# EAGLE design Monarch (EAGLE 7.4.0)

## Sheet 1 of 2
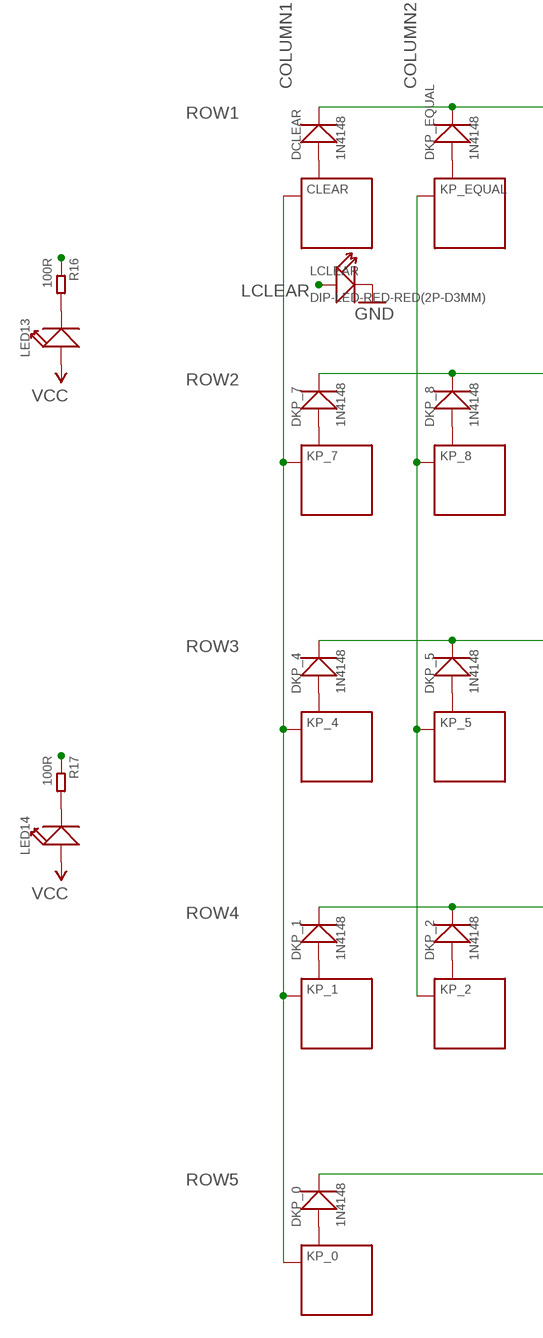
[diagram p0: schematic, sheet 1, part 1 of 2]
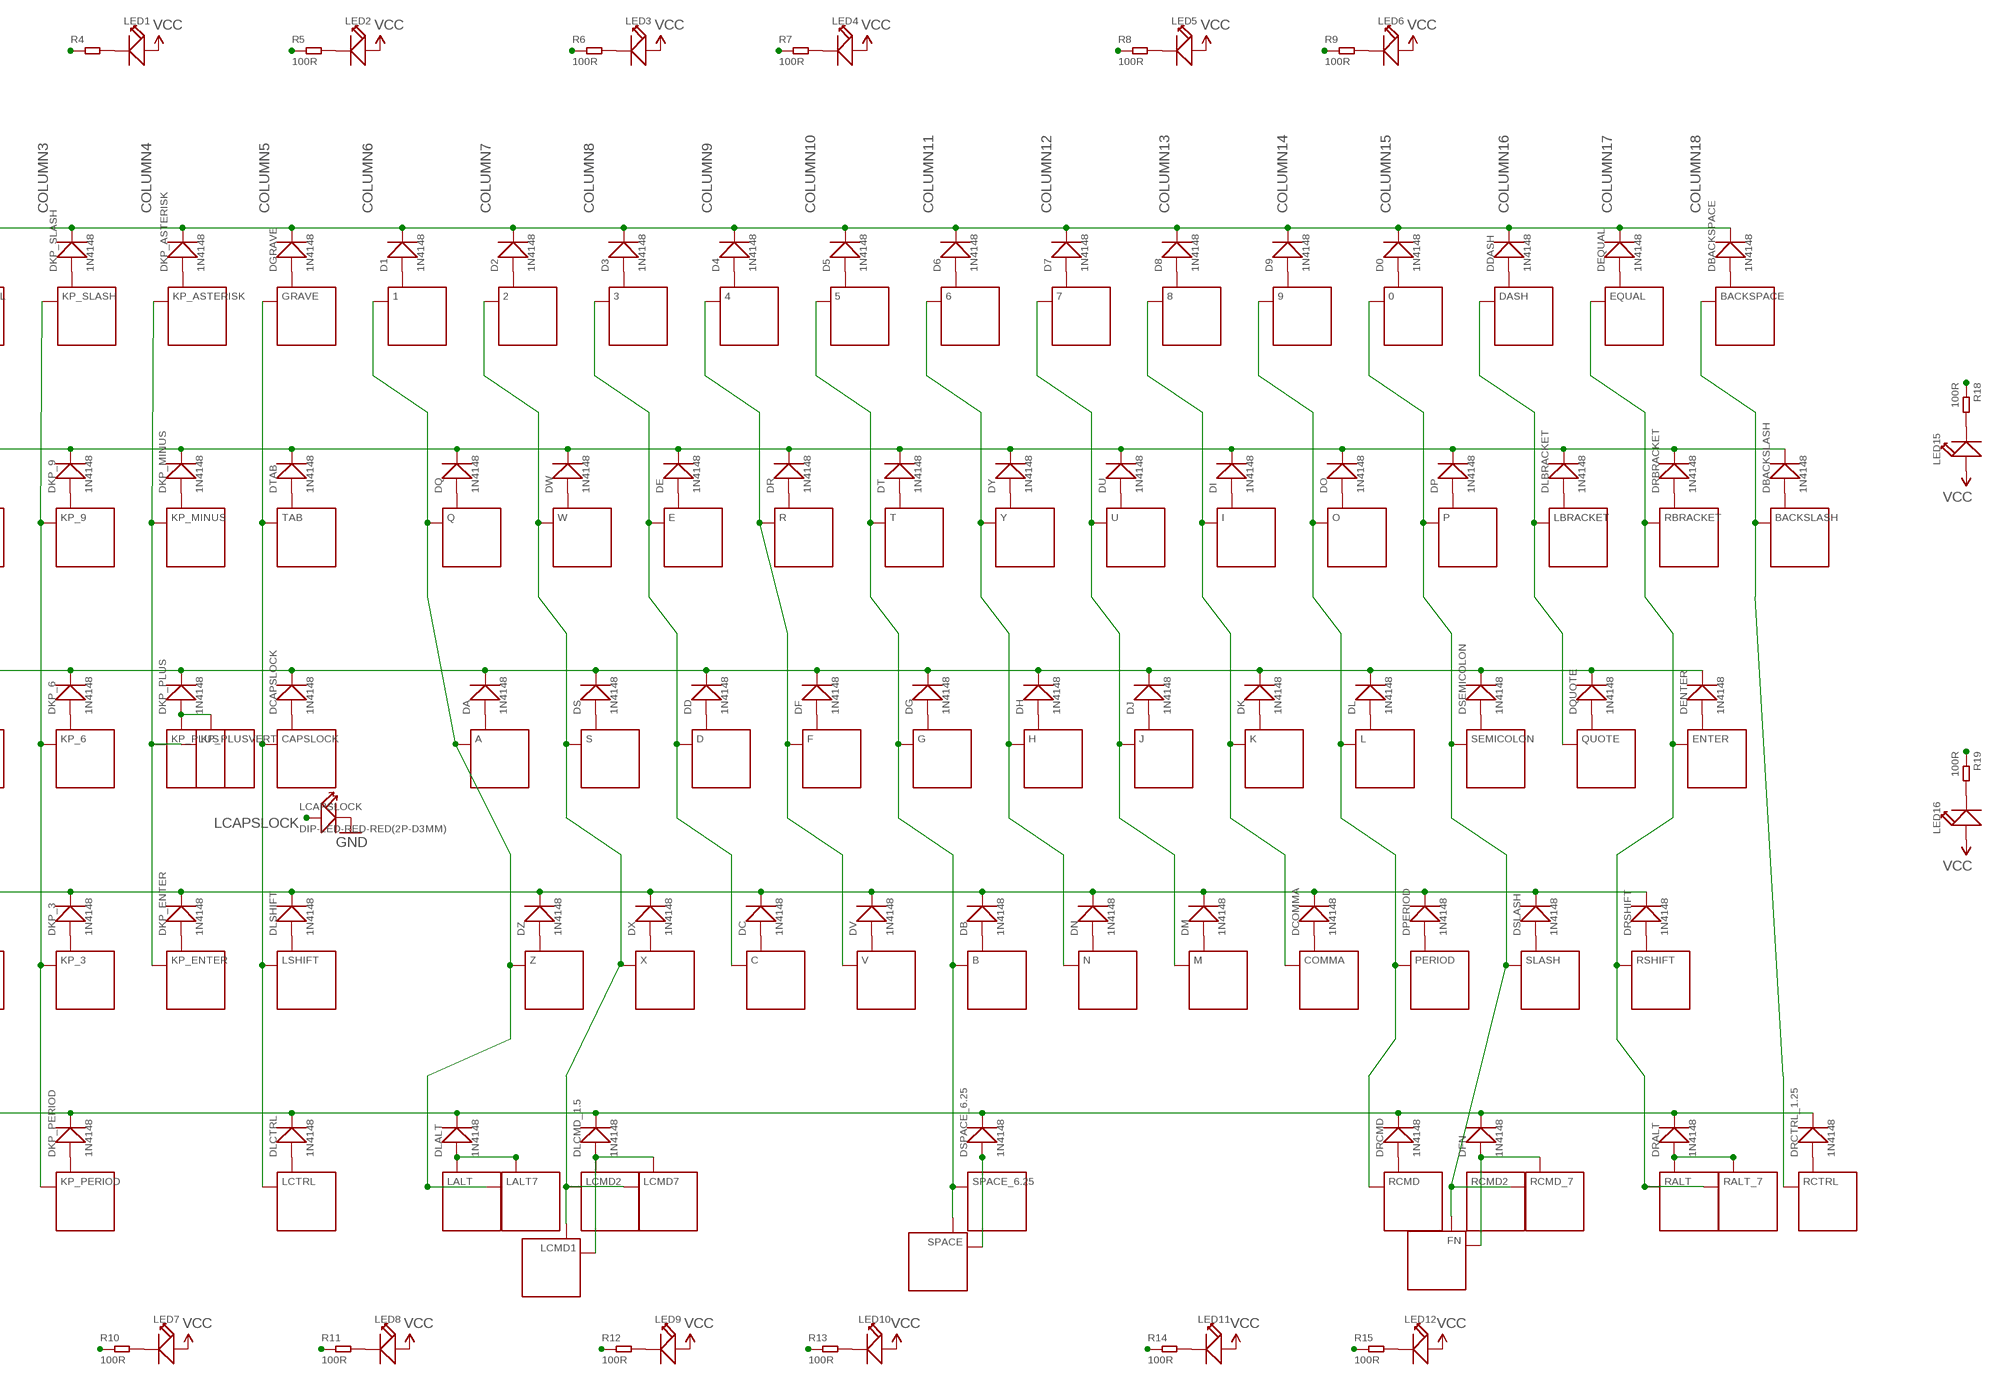
[diagram p1: schematic, sheet 1, part 2 of 2]

### Parts
0  ALPS  [P-ALPS]
1  ALPS  [P-ALPS]
2  ALPS  [P-ALPS]
3  ALPS  [P-ALPS]
4  ALPS  [P-ALPS]
5  ALPS  [P-ALPS]
6  ALPS  [P-ALPS]
7  ALPS  [P-ALPS]
8  ALPS  [P-ALPS]
9  ALPS  [P-ALPS]
A  ALPS  [P-ALPS]
B  ALPS  [P-ALPS]
BACKSLASH  ALPS  [P-ALPS]
BACKSPACE  ALPS  [P-ALPS]
C  ALPS  [P-ALPS]
CAPSLOCK  ALPS  [P-ALPS]
CLEAR  ALPS  [P-ALPS]
COMMA  ALPS  [P-ALPS]
D  ALPS  [P-ALPS]
D0  1N4148  DIODE'1206'  [SOD-123]
D1  1N4148  DIODE'1206'  [SOD-123]
D2  1N4148  DIODE'1206'  [SOD-123]
D3  1N4148  DIODE'1206'  [SOD-123]
D4  1N4148  DIODE'1206'  [SOD-123]
D5  1N4148  DIODE'1206'  [SOD-123]
D6  1N4148  DIODE'1206'  [SOD-123]
D7  1N4148  DIODE'1206'  [SOD-123]
D8  1N4148  DIODE'1206'  [SOD-123]
D9  1N4148  DIODE'1206'  [SOD-123]
DA  1N4148  DIODE'1206'  [SOD-123]
DASH  ALPS  [P-ALPS]
DB  1N4148  DIODE'1206'  [SOD-123]
DBACKSLASH  1N4148  DIODE'1206'  [SOD-123]
DBACKSPACE  1N4148  DIODE'1206'  [SOD-123]
DC  1N4148  DIODE'1206'  [SOD-123]
DCAPSLOCK  1N4148  DIODE'1206'  [SOD-123]
DCLEAR  1N4148  DIODE'1206'  [SOD-123]
DCOMMA  1N4148  DIODE'1206'  [SOD-123]
DD  1N4148  DIODE'1206'  [SOD-123]
DDASH  1N4148  DIODE'1206'  [SOD-123]
DE  1N4148  DIODE'1206'  [SOD-123]
DENTER  1N4148  DIODE'1206'  [SOD-123]
DEQUAL  1N4148  DIODE'1206'  [SOD-123]
DF  1N4148  DIODE'1206'  [SOD-123]
DFN  1N4148  DIODE'1206'  [SOD-123]
DG  1N4148  DIODE'1206'  [SOD-123]
DGRAVE  1N4148  DIODE'1206'  [SOD-123]
DH  1N4148  DIODE'1206'  [SOD-123]
DI  1N4148  DIODE'1206'  [SOD-123]
DJ  1N4148  DIODE'1206'  [SOD-123]
DK  1N4148  DIODE'1206'  [SOD-123]
DKP_0  1N4148  DIODE'1206'  [SOD-123]
DKP_1  1N4148  DIODE'1206'  [SOD-123]
DKP_2  1N4148  DIODE'1206'  [SOD-123]
DKP_3  1N4148  DIODE'1206'  [SOD-123]
DKP_4  1N4148  DIODE'1206'  [SOD-123]
DKP_5  1N4148  DIODE'1206'  [SOD-123]
DKP_6  1N4148  DIODE'1206'  [SOD-123]
DKP_7  1N4148  DIODE'1206'  [SOD-123]
DKP_8  1N4148  DIODE'1206'  [SOD-123]
DKP_9  1N4148  DIODE'1206'  [SOD-123]
DKP_ASTERISK  1N4148  DIODE'1206'  [SOD-123]
DKP_ENTER  1N4148  DIODE'1206'  [SOD-123]
DKP_EQUAL  1N4148  DIODE'1206'  [SOD-123]
DKP_MINUS  1N4148  DIODE'1206'  [SOD-123]
DKP_PERIOD  1N4148  DIODE'1206'  [SOD-123]
DKP_PLUS  1N4148  DIODE'1206'  [SOD-123]
DKP_SLASH  1N4148  DIODE'1206'  [SOD-123]
DL  1N4148  DIODE'1206'  [SOD-123]
DLALT  1N4148  DIODE'1206'  [SOD-123]
DLBRACKET  1N4148  DIODE'1206'  [SOD-123]
DLCMD_1.5  1N4148  DIODE'1206'  [SOD-123]
DLCTRL  1N4148  DIODE'1206'  [SOD-123]
DLSHIFT  1N4148  DIODE'1206'  [SOD-123]
DM  1N4148  DIODE'1206'  [SOD-123]
DN  1N4148  DIODE'1206'  [SOD-123]
DO  1N4148  DIODE'1206'  [SOD-123]
DP  1N4148  DIODE'1206'  [SOD-123]
DPERIOD  1N4148  DIODE'1206'  [SOD-123]
DQ  1N4148  DIODE'1206'  [SOD-123]
DQUOTE  1N4148  DIODE'1206'  [SOD-123]
DR  1N4148  DIODE'1206'  [SOD-123]
DRALT  1N4148  DIODE'1206'  [SOD-123]
DRBRACKET  1N4148  DIODE'1206'  [SOD-123]
DRCMD  1N4148  DIODE'1206'  [SOD-123]
DRCTRL_1.25  1N4148  DIODE'1206'  [SOD-123]
DRSHIFT  1N4148  DIODE'1206'  [SOD-123]
DS  1N4148  DIODE'1206'  [SOD-123]
DSEMICOLON  1N4148  DIODE'1206'  [SOD-123]
DSLASH  1N4148  DIODE'1206'  [SOD-123]
DSPACE_6.25  1N4148  DIODE'1206'  [SOD-123]
DT  1N4148  DIODE'1206'  [SOD-123]
DTAB  1N4148  DIODE'1206'  [SOD-123]
DU  1N4148  DIODE'1206'  [SOD-123]
DV  1N4148  DIODE'1206'  [SOD-123]
DW  1N4148  DIODE'1206'  [SOD-123]
DX  1N4148  DIODE'1206'  [SOD-123]
DY  1N4148  DIODE'1206'  [SOD-123]
DZ  1N4148  DIODE'1206'  [SOD-123]
E  ALPS  [P-ALPS]
ENTER  ALPS  [P-ALPS]
EQUAL  ALPS  [P-ALPS]
F  ALPS  [P-ALPS]
FN  ALPS  [P-ALPS]
G  ALPS  [P-ALPS]
GRAVE  ALPS  [P-ALPS]
H  ALPS  [P-ALPS]
I  ALPS  [P-ALPS]
J  ALPS  [P-ALPS]
K  ALPS  [P-ALPS]
KP_0  ALPS  [P-ALPS]
KP_1  ALPS  [P-ALPS]
KP_2  ALPS  [P-ALPS]
KP_3  ALPS  [P-ALPS]
KP_4  ALPS  [P-ALPS]
KP_5  ALPS  [P-ALPS]
KP_6  ALPS  [P-ALPS]
KP_7  ALPS  [P-ALPS]
KP_8  ALPS  [P-ALPS]
KP_9  ALPS  [P-ALPS]
KP_ASTERISK  ALPS  [P-ALPS]
KP_ENTER  ALPS  [P-ALPS]
KP_EQUAL  ALPS  [P-ALPS]
KP_MINUS  ALPS  [P-ALPS]
KP_PERIOD  ALPS  [P-ALPS]
KP_PLUS  ALPS  [P-ALPS]
KP_PLUSVERT  ALPS  [P-ALPS]
KP_SLASH  ALPS  [P-ALPS]
L  ALPS  [P-ALPS]
LALT  ALPS-2SWITCH-0.5  [P-ALPS-2SWITCH-0.5]
LALT7  ALPS  [P-ALPS]
LBRACKET  ALPS  [P-ALPS]
LCAPSLOCK  DIP-LED-RED-RED(2P-D3MM)  [LED2-2.54-D3.0MM]
LCLEAR  DIP-LED-RED-RED(2P-D3MM)  [LED2-2.54-D3.0MM]
LCMD1  ALPS  [P-ALPS]
LCMD2  ALPS  [P-ALPS]
LCMD7  ALPS  [P-ALPS]
LCTRL  ALPS-2SWITCH-0.25  [P-ALPS-2SWITCH-0.25]
LED1  SMD-LED-GENERIC  [P-SMD-LED-GENERIC]
LED2  SMD-LED-GENERIC  [P-SMD-LED-GENERIC]
LED3  SMD-LED-GENERIC  [P-SMD-LED-GENERIC]
LED4  SMD-LED-GENERIC  [P-SMD-LED-GENERIC]
LED5  SMD-LED-GENERIC  [P-SMD-LED-GENERIC]
LED6  SMD-LED-GENERIC  [P-SMD-LED-GENERIC]
LED7  SMD-LED-GENERIC  [P-SMD-LED-GENERIC]
LED8  SMD-LED-GENERIC  [P-SMD-LED-GENERIC]
LED9  SMD-LED-GENERIC  [P-SMD-LED-GENERIC]
LED10  SMD-LED-GENERIC  [P-SMD-LED-GENERIC]
LED11  SMD-LED-GENERIC  [P-SMD-LED-GENERIC]
LED12  SMD-LED-GENERIC  [P-SMD-LED-GENERIC]
LED13  SMD-LED-GENERIC  [P-SMD-LED-GENERIC]
LED14  SMD-LED-GENERIC  [P-SMD-LED-GENERIC]
LED15  SMD-LED-GENERIC  [P-SMD-LED-GENERIC]
LED16  SMD-LED-GENERIC  [P-SMD-LED-GENERIC]
LSHIFT  ALPS  [P-ALPS]
M  ALPS  [P-ALPS]
N  ALPS  [P-ALPS]
O  ALPS  [P-ALPS]
P  ALPS  [P-ALPS]
PERIOD  ALPS  [P-ALPS]
Q  ALPS  [P-ALPS]
QUOTE  ALPS  [P-ALPS]
R  ALPS  [P-ALPS]
R4  SMD-RES-100R-5%-1/8W(0805)  [R0805]
R5  100R  SMD-RES-100R-5%-1/8W(0805)  [R0805]
R6  100R  SMD-RES-100R-5%-1/8W(0805)  [R0805]
R7  100R  SMD-RES-100R-5%-1/8W(0805)  [R0805]
R8  100R  SMD-RES-100R-5%-1/8W(0805)  [R0805]
R9  100R  SMD-RES-100R-5%-1/8W(0805)  [R0805]
R10  100R  SMD-RES-100R-5%-1/8W(0805)  [R0805]
R11  100R  SMD-RES-100R-5%-1/8W(0805)  [R0805]
R12  100R  SMD-RES-100R-5%-1/8W(0805)  [R0805]
R13  100R  SMD-RES-100R-5%-1/8W(0805)  [R0805]
R14  100R  SMD-RES-100R-5%-1/8W(0805)  [R0805]
R15  100R  SMD-RES-100R-5%-1/8W(0805)  [R0805]
R16  100R  SMD-RES-100R-5%-1/8W(0805)  [R0805]
R17  100R  SMD-RES-100R-5%-1/8W(0805)  [R0805]
R18  100R  SMD-RES-100R-5%-1/8W(0805)  [R0805]
R19  100R  SMD-RES-100R-5%-1/8W(0805)  [R0805]
RALT  ALPS-2SWITCH-0.5  [P-ALPS-2SWITCH-0.5]
RALT_7  ALPS  [P-ALPS]
RBRACKET  ALPS  [P-ALPS]
RCMD  ALPS  [P-ALPS]
RCMD2  ALPS  [P-ALPS]
RCMD_7  ALPS  [P-ALPS]
RCTRL  ALPS-2SWITCH-0.25  [P-ALPS-2SWITCH-0.25]
RSHIFT  ALPS  [P-ALPS]
S  ALPS  [P-ALPS]
SEMICOLON  ALPS  [P-ALPS]
SLASH  ALPS  [P-ALPS]
SPACE  ALPS  [P-ALPS]
SPACE_6.25  ALPS  [P-ALPS]
T  ALPS  [P-ALPS]
TAB  ALPS  [P-ALPS]
U  ALPS  [P-ALPS]
V  ALPS  [P-ALPS]
W  ALPS  [P-ALPS]
X  ALPS  [P-ALPS]
Y  ALPS  [P-ALPS]
Z  ALPS  [P-ALPS]

### Nets
COLUMN1: CLEAR.ALPS1 KP_0.ALPS1 KP_1.ALPS1 KP_4.ALPS1 KP_7.ALPS1 ; also sheet 2
COLUMN2: KP_2.ALPS1 KP_5.ALPS1 KP_8.ALPS1 KP_EQUAL.ALPS1 ; also sheet 2
COLUMN3: KP_3.ALPS1 KP_6.ALPS1 KP_9.ALPS1 KP_PERIOD.ALPS1 KP_SLASH.ALPS1 ; also sheet 2
COLUMN4: KP_ASTERISK.ALPS1 KP_ENTER.ALPS1 KP_MINUS.ALPS1 KP_PLUS.ALPS1 KP_PLUSVERT.ALPS1 ; also sheet 2
COLUMN5: CAPSLOCK.ALPS1 GRAVE.ALPS1 LCTRL.ALPS1 LCTRL.ALPS3 LSHIFT.ALPS1 TAB.ALPS1 ; also sheet 2
COLUMN6: 1.ALPS1 A.ALPS1 LALT7.ALPS1 LALT.ALPS1 LALT.ALPS4 Q.ALPS1 Z.ALPS1 ; also sheet 2
COLUMN7: 2.ALPS1 LCMD1.ALPS2 LCMD2.ALPS1 LCMD7.ALPS1 S.ALPS1 W.ALPS1 X.ALPS1 ; also sheet 2
COLUMN8: 3.ALPS1 C.ALPS1 D.ALPS1 E.ALPS1 ; also sheet 2
COLUMN9: 4.ALPS1 F.ALPS1 R.ALPS1 V.ALPS1 ; also sheet 2
COLUMN10: 5.ALPS1 B.ALPS1 G.ALPS1 SPACE.ALPS2 SPACE_6.25.ALPS1 T.ALPS1 ; also sheet 2
COLUMN11: 6.ALPS1 H.ALPS1 N.ALPS1 Y.ALPS1 ; also sheet 2
COLUMN12: 7.ALPS1 J.ALPS1 M.ALPS1 U.ALPS1 ; also sheet 2
COLUMN13: 8.ALPS1 COMMA.ALPS1 I.ALPS1 K.ALPS1 ; also sheet 2
COLUMN14: 9.ALPS1 L.ALPS1 O.ALPS1 PERIOD.ALPS1 RCMD.ALPS1 ; also sheet 2
COLUMN15: 0.ALPS1 FN.ALPS2 P.ALPS1 RCMD2.ALPS1 RCMD_7.ALPS1 SEMICOLON.ALPS1 SLASH.ALPS1 ; also sheet 2
COLUMN16: DASH.ALPS1 LBRACKET.ALPS1 QUOTE.ALPS1 ; also sheet 2
COLUMN17: ENTER.ALPS1 EQUAL.ALPS1 RALT.ALPS1 RALT.ALPS4 RALT_7.ALPS1 RBRACKET.ALPS1 RSHIFT.ALPS1 ; also sheet 2
COLUMN18: BACKSLASH.ALPS1 BACKSPACE.ALPS1 RCTRL.ALPS1 RCTRL.ALPS3 ; also sheet 2
GND: LCAPSLOCK.K(-) LCLEAR.K(-) ; also sheet 2
LCAPSLOCK: LCAPSLOCK.A(+) ; also sheet 2
LCLEAR: LCLEAR.A(+) ; also sheet 2
N$1: CLEAR.ALPS2 DCLEAR.+
N$2: DKP_SLASH.+ KP_SLASH.ALPS2
N$3: DKP_ASTERISK.+ KP_ASTERISK.ALPS2
N$4: DKP_MINUS.+ KP_MINUS.ALPS2
N$5: DGRAVE.+ GRAVE.ALPS2
N$6: 1.ALPS2 D1.+
N$7: 2.ALPS2 D2.+
N$8: 3.ALPS2 D3.+
N$9: 4.ALPS2 D4.+
N$10: 5.ALPS2 D5.+
N$11: 6.ALPS2 D6.+
N$12: 7.ALPS2 D7.+
N$13: 8.ALPS2 D8.+
N$14: 9.ALPS2 D9.+
N$15: 0.ALPS2 D0.+
N$16: DASH.ALPS2 DDASH.+
N$17: DEQUAL.+ EQUAL.ALPS2
N$18: BACKSPACE.ALPS2 DBACKSPACE.+
N$19: DKP_7.+ KP_7.ALPS2
N$20: DKP_8.+ KP_8.ALPS2
N$21: DKP_9.+ KP_9.ALPS2
N$22: DKP_PLUS.+ KP_PLUS.ALPS2 KP_PLUSVERT.ALPS2
N$23: DTAB.+ TAB.ALPS2
N$24: DQ.+ Q.ALPS2
N$25: DW.+ W.ALPS2
N$26: DE.+ E.ALPS2
N$27: DR.+ R.ALPS2
N$28: DT.+ T.ALPS2
N$29: DY.+ Y.ALPS2
N$30: DU.+ U.ALPS2
N$31: DI.+ I.ALPS2
N$32: DO.+ O.ALPS2
N$33: DP.+ P.ALPS2
N$34: DLBRACKET.+ LBRACKET.ALPS2
N$35: DRBRACKET.+ RBRACKET.ALPS2
N$36: BACKSLASH.ALPS2 DBACKSLASH.+
N$37: DKP_4.+ KP_4.ALPS2
N$38: DKP_5.+ KP_5.ALPS2
N$39: DKP_6.+ KP_6.ALPS2
N$40: CAPSLOCK.ALPS2 DCAPSLOCK.+
N$41: A.ALPS2 DA.+
N$42: DS.+ S.ALPS2
N$43: D.ALPS2 DD.+
N$44: DF.+ F.ALPS2
N$45: DG.+ G.ALPS2
N$46: DH.+ H.ALPS2
N$47: DJ.+ J.ALPS2
N$48: DK.+ K.ALPS2
N$49: DL.+ L.ALPS2
N$50: DSEMICOLON.+ SEMICOLON.ALPS2
N$51: DQUOTE.+ QUOTE.ALPS2
N$52: DENTER.+ ENTER.ALPS2
N$53: DKP_1.+ KP_1.ALPS2
N$54: DKP_2.+ KP_2.ALPS2
N$55: DKP_3.+ KP_3.ALPS2
N$56: DKP_ENTER.+ KP_ENTER.ALPS2
N$57: DLSHIFT.+ LSHIFT.ALPS2
N$58: DZ.+ Z.ALPS2
N$59: DX.+ X.ALPS2
N$60: C.ALPS2 DC.+
N$61: DV.+ V.ALPS2
N$62: B.ALPS2 DB.+
N$63: DN.+ N.ALPS2
N$64: DM.+ M.ALPS2
N$65: COMMA.ALPS2 DCOMMA.+
N$66: DPERIOD.+ PERIOD.ALPS2
N$67: DSLASH.+ SLASH.ALPS2
N$68: DRSHIFT.+ RSHIFT.ALPS2
N$69: DKP_0.+ KP_0.ALPS2
N$70: DKP_PERIOD.+ KP_PERIOD.ALPS2
N$71: DLCTRL.+ LCTRL.ALPS2 LCTRL.ALPS4
N$72: DFN.+ FN.ALPS1 RCMD2.ALPS2 RCMD_7.ALPS2
N$75: DKP_EQUAL.+ KP_EQUAL.ALPS2
N$76: DLALT.+ LALT7.ALPS2 LALT.ALPS2 LALT.ALPS3
N$78: DLCMD_1.5.+ LCMD1.ALPS1 LCMD2.ALPS2 LCMD7.ALPS2
N$79: DSPACE_6.25.+ SPACE.ALPS1 SPACE_6.25.ALPS2
N$81: DRCMD.+ RCMD.ALPS2
N$85: DRALT.+ RALT.ALPS2 RALT.ALPS3 RALT_7.ALPS2
N$87: DRCTRL_1.25.+ RCTRL.ALPS2 RCTRL.ALPS4
N$91: LED1.MINUS R4.2
N$92: LED2.MINUS R5.2
N$93: LED3.MINUS R6.2
N$94: LED4.MINUS R7.2
N$95: LED5.MINUS R8.2
N$96: LED6.MINUS R9.2
N$97: LED15.MINUS R18.2
N$98: LED16.MINUS R19.2
N$99: LED12.MINUS R15.2
N$100: LED11.MINUS R14.2
N$101: LED10.MINUS R13.2
N$102: LED9.MINUS R12.2
N$103: LED8.MINUS R11.2
N$104: LED7.MINUS R10.2
N$105: LED14.MINUS R17.2
N$106: LED13.MINUS R16.2
ROW1: D0.- D1.- D2.- D3.- D4.- D5.- D6.- D7.- D8.- D9.- DBACKSPACE.- DCLEAR.- DDASH.- DEQUAL.- DGRAVE.- DKP_ASTERISK.- DKP_EQUAL.- DKP_SLASH.- ; also sheet 2
ROW2: DBACKSLASH.- DE.- DI.- DKP_7.- DKP_8.- DKP_9.- DKP_MINUS.- DLBRACKET.- DO.- DP.- DQ.- DR.- DRBRACKET.- DT.- DTAB.- DU.- DW.- DY.- ; also sheet 2
ROW3: DA.- DCAPSLOCK.- DD.- DENTER.- DF.- DG.- DH.- DJ.- DK.- DKP_4.- DKP_5.- DKP_6.- DKP_PLUS.- DL.- DQUOTE.- DS.- DSEMICOLON.- ; also sheet 2
ROW4: DB.- DC.- DCOMMA.- DKP_1.- DKP_2.- DKP_3.- DKP_ENTER.- DLSHIFT.- DM.- DN.- DPERIOD.- DRSHIFT.- DSLASH.- DV.- DX.- DZ.- ; also sheet 2
ROW5: DFN.- DKP_0.- DKP_PERIOD.- DLALT.- DLCMD_1.5.- DLCTRL.- DRALT.- DRCMD.- DRCTRL_1.25.- DSPACE_6.25.- ; also sheet 2
UNDERLIGHT: R4.1 R5.1 R6.1 R7.1 R8.1 R9.1 R10.1 R11.1 R12.1 R13.1 R14.1 R15.1 R16.1 R17.1 R18.1 R19.1 ; also sheet 2
VCC: LED1.PLUS LED2.PLUS LED3.PLUS LED4.PLUS LED5.PLUS LED6.PLUS LED7.PLUS LED8.PLUS LED9.PLUS LED10.PLUS LED11.PLUS LED12.PLUS LED13.PLUS LED14.PLUS LED15.PLUS LED16.PLUS ; also sheet 2

## Sheet 2 of 2
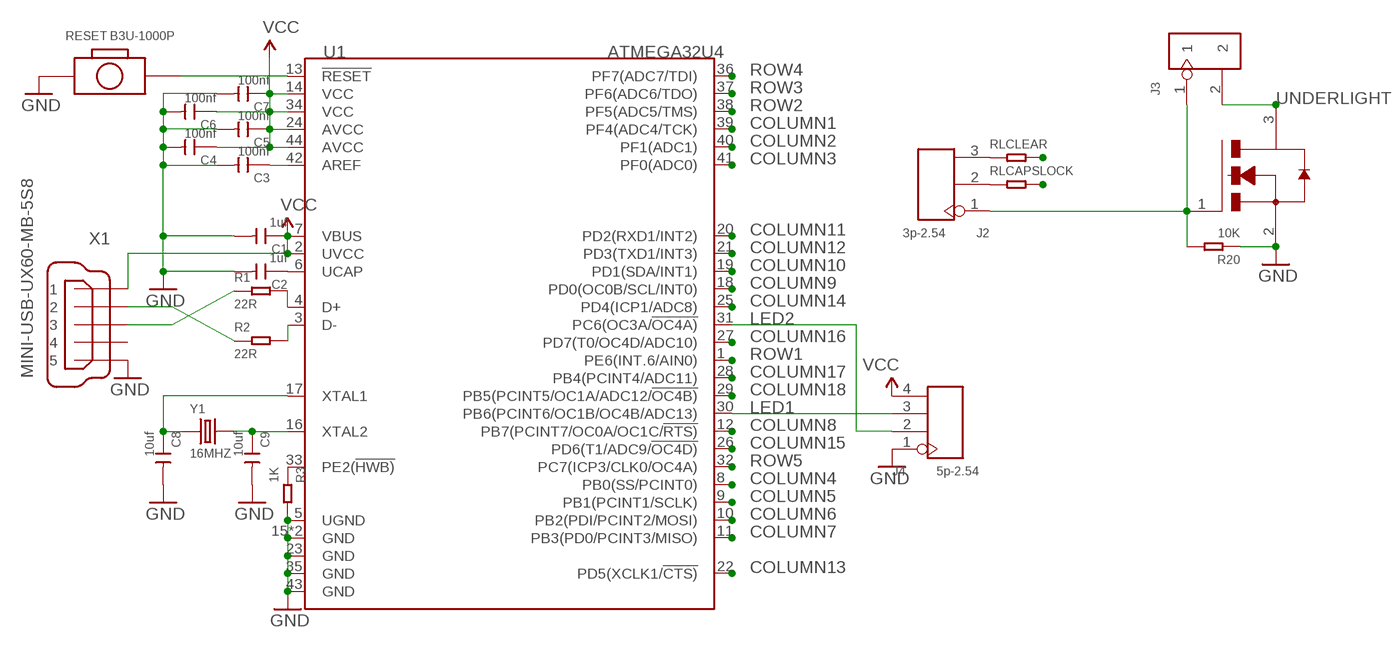
[diagram p2: schematic, sheet 2]

### Parts
C1  1uf  CERAMIC-1UF-25V-10%-X7R(0805)  [C0805]
C2  1uf  CERAMIC-1UF-25V-10%-X7R(0805)  [C0805]
C3  100nf  CERAMIC-100NF-50V-10%-X7R(0805)  [C0805]
C4  100nf  CERAMIC-100NF-50V-10%-X7R(0805)  [C0805]
C5  100nf  CERAMIC-100NF-50V-10%-X7R(0805)  [C0805]
C6  100nf  CERAMIC-100NF-50V-10%-X7R(0805)  [C0805]
C7  100nf  CERAMIC-100NF-50V-10%-X7R(0805)  [C0805]
C8  10uf  CERAMIC-10UF-25V-10%-X5R(0805)  [C0805]
C9  10uf  CERAMIC-10UF-25V-10%-X5R(0805)  [C0805]
FET1  MOSFET  [SOT23]
J2  3p-2.54  DIP-BLACK-FEMALE-HEADER-VERT(3P-2.54)  [H3-2.54]
J3  DIP-BLACK-FEMALE-HEADER-VERT(2P-2.54)  [H2-2.54]
J4  5p-2.54  DIP-BLACK-MALE-HEADER-VERT(4P-2.54)  [H4-2.54]
R1  22R  SMD-RES-22R-5%-1/8W(0805)  [R0805]
R2  22R  SMD-RES-22R-5%-1/8W(0805)  [R0805]
R3  1K  SMD-RES-1K-5%-1/8W(0805)  [R0805]
R20  10K  SMD-RES-10K-1%-1/8W(0805)  [R0805]
RESET  B3U-1000P  SMD-BUTTON-WITHOUT-BOSS-(2P-3X2.5MM)  [SW2-SMD-3.0X2.5X1.2+0.4MM]
RLCAPSLOCK  RES-0309/10  [R0309_10]
RLCLEAR  RES-0309/10  [R0309_10]
U1  ATMEGA32U4  MCU-ATMEGA32U4-MUR(VQFN44)  [QFN44G-0.5-7X7MM]
X1  MINI-USB-UX60-MB-5S8  [UX60-MB-5S8]
Y1  16MHZ  SMD-CRYSTAL-16MHZ-8PF-20PPM-40R(2P-5.0X3.2MM)  [X2-SMD-5.0X3.2X1.3MM]

### Nets
COLUMN1: U1.39(PF4(ADC4/TCK)) ; also sheet 1
COLUMN2: U1.40(PF1(ADC1)) ; also sheet 1
COLUMN3: U1.41(PF0(ADC0)) ; also sheet 1
COLUMN4: U1.8(PB0(SS/PCINT0)) ; also sheet 1
COLUMN5: U1.9(PB1(PCINT1/SCLK)) ; also sheet 1
COLUMN6: U1.10(PB2(PDI/PCINT2/MOSI)) ; also sheet 1
COLUMN7: U1.11(PB3(PD0/PCINT3/MISO)) ; also sheet 1
COLUMN8: U1.12(PB7(PCINT7/OC0A/OC1C/!RTS)) ; also sheet 1
COLUMN9: U1.18(PD0(OC0B/SCL/INT0)) ; also sheet 1
COLUMN10: U1.19(PD1(SDA/INT1)) ; also sheet 1
COLUMN11: U1.20(PD2(RXD1/INT2)) ; also sheet 1
COLUMN12: U1.21(PD3(TXD1/INT3)) ; also sheet 1
COLUMN13: U1.22(PD5(XCLK1/!CTS)) ; also sheet 1
COLUMN14: U1.25(PD4(ICP1/ADC8)) ; also sheet 1
COLUMN15: U1.26(PD6(T1/ADC9/!OC4D)) ; also sheet 1
COLUMN16: U1.27(PD7(T0/OC4D/ADC10)) ; also sheet 1
COLUMN17: U1.28(PB4(PCINT4/ADC11)) ; also sheet 1
COLUMN18: U1.29(PB5(PCINT5/OC1A/ADC12/!OC4B)) ; also sheet 1
GND: C1.2 C2.2 C3.2 C4.2 C5.2 C6.2 C7.2 C8.2 C9.2 FET1.2(SOURCE) J4.1 R3.2 R20.1 RESET.1 U1.5(UGND) U1.15(GND) U1.23(GND) U1.35(GND) U1.43(GND) U1.TAB(GND) X1.5 ; also sheet 1
LCAPSLOCK: RLCAPSLOCK.2 ; also sheet 1
LCLEAR: RLCLEAR.2 ; also sheet 1
LED1: J4.3 U1.30(PB6(PCINT6/OC1B/OC4B/ADC13))
LED2: J4.2 U1.31(PC6(OC3A/!OC4A))
N$73: R1.2 U1.4(D+)
N$74: R2.2 U1.3(D-)
N$77: C2.1 U1.6(UCAP)
N$80: C8.1 U1.17(XTAL1) Y1.1
N$82: C9.1 U1.16(XTAL2) Y1.2
N$83: R3.1 U1.33(PE2(!HWB))
N$84: C3.1 U1.42(AREF)
N$86: J2.2 RLCAPSLOCK.1
N$88: R1.1 X1.3
N$89: R2.1 X1.2
N$90: J2.3 RLCLEAR.1
N$154: FET1.1(GATE) J2.1 J3.1 R20.2
RESET: RESET.2 U1.13(!RESET)
ROW1: U1.1(PE6(INT.6/AIN0)) ; also sheet 1
ROW2: U1.38(PF5(ADC5/TMS)) ; also sheet 1
ROW3: U1.37(PF6(ADC6/TDO)) ; also sheet 1
ROW4: U1.36(PF7(ADC7/TDI)) ; also sheet 1
ROW5: U1.32(PC7(ICP3/CLK0/OC4A)) ; also sheet 1
UNDERLIGHT: FET1.3(DRAIN) J3.2 ; also sheet 1
VCC: C1.1 C4.1 C5.1 C6.1 C7.1 J4.4 U1.2(UVCC) U1.7(VBUS) U1.14(VCC) U1.24(AVCC) U1.34(VCC) U1.44(AVCC) X1.1 ; also sheet 1
Unconnected: X1.4

## Library data of the parts
0 1-9 A B BACKSLASH BACKSPACE C CAPSLOCK CLEAR COMMA D DASH E ENTER EQUAL F FN G GRAVE H I J K KP_0 KP_1-KP_9 KP_ASTERISK KP_ENTER KP_EQUAL KP_MINUS KP_PERIOD KP_PLUS KP_PLUSVERT KP_SLASH L LALT7 LBRACKET LCMD1 LCMD2 LCMD7 LSHIFT M N O P PERIOD Q QUOTE R RALT_7 RBRACKET RCMD RCMD2 RCMD_7 RSHIFT S SEMICOLON SLASH SPACE SPACE_6.25 T TAB U V W X Y Z = AlpsCherry:ALPS
C1 C2 = Seeed-OPL-Capacitor:CERAMIC-1UF-25V-10%-X7R(0805): 302010179; MPN: CC0805KKX7R8BB105
C3-C7 = Seeed-OPL-Capacitor:CERAMIC-100NF-50V-10%-X7R(0805): 302010165; MPN: CC0805KRX7R9BB104
C8 C9 = Seeed-OPL-Capacitor:CERAMIC-10UF-25V-10%-X5R(0805): 302010178; MPN: CC0805KKX5R8BB106
D0 D1-D9 DA DB DBACKSLASH DBACKSPACE DC DCAPSLOCK DCLEAR DCOMMA DD DDASH DE DENTER DEQUAL DF DFN DG DGRAVE DH DI DJ DK DKP_0 DKP_1-DKP_9 DKP_ASTERISK DKP_ENTER DKP_EQUAL DKP_MINUS DKP_PERIOD DKP_PLUS DKP_SLASH DL DLALT DLBRACKET DLCMD_1.5 DLCTRL DLSHIFT DM DN DO DP DPERIOD DQ DQUOTE DR DRALT DRBRACKET DRCMD DRCTRL_1.25 DRSHIFT DS DSEMICOLON DSLASH DSPACE_6.25 DT DTAB DU DV DW DX DY DZ = Seeed-OPL-Diode:DIODE*
FET1 = smd-ipc:MOSFET
J2 = Seeed-OPL-Connector:DIP-BLACK-FEMALE-HEADER-VERT(3P-2.54): 320030024; MPN: F185-1103A0BSYA1
J3 = Seeed-OPL-Connector:DIP-BLACK-FEMALE-HEADER-VERT(2P-2.54): 320030023; MPN: F185-1102A1BSYA1
J4 = Seeed-OPL-Connector:DIP-BLACK-MALE-HEADER-VERT(4P-2.54): 320020017; MPN: P125-1104A0BS116A1
LALT RALT = AlpsCherry:ALPS-2SWITCH-0.5
LCAPSLOCK LCLEAR = Seeed-OPL-Diode:DIP-LED-RED-RED(2P-D3MM): 304090041; MPN: SR302DC
LCTRL RCTRL = AlpsCherry:ALPS-2SWITCH-0.25
LED1-LED16 = AlpsCherry:SMD-LED-GENERIC
R1 R2 = Seeed-OPL-Resistor:SMD-RES-22R-5%-1/8W(0805): 301010329; MPN: RC0805JR-0722RL
R3 = Seeed-OPL-Resistor:SMD-RES-1K-5%-1/8W(0805): 301010311; MPN: RC0805JR-071KL
R4 = Seeed-OPL-Resistor:SMD-RES-100R-5%-1/8W(0805): 301010319; MPN: RC0805JR-07100RL; VALUE: 100R
R5-R19 = Seeed-OPL-Resistor:SMD-RES-100R-5%-1/8W(0805): 301010319; MPN: RC0805JR-07100RL
R20 = Seeed-OPL-Resistor:SMD-RES-10K-1%-1/8W(0805): 301010361; MPN: RC0805FR-0710KL
RESET = Seeed-OPL-Button:SMD-BUTTON-WITHOUT-BOSS-(2P-3X2.5MM): 311020047
RLCAPSLOCK RLCLEAR = Seeed-OPL-Resistor:RES
U1 = Seeed-OPL-ic:MCU-ATMEGA32U4-MUR(VQFN44): 310010016; MPN: ATMEGA32U4-MUR
X1 = con-hirose:MINI-USB-: MINI USB Connector Source: http://www.hirose.co.jp/cataloge_hp/e24000019.pdf; OC_FARNELL: unknown; OC_NEWARK: unknown
Y1 = Seeed-OPL-crystal-osctllator:SMD-CRYSTAL-16MHZ-8PF-20PPM-40R(2P-5.0X3.2MM): 306010054; MPN: X053201602002

## Board
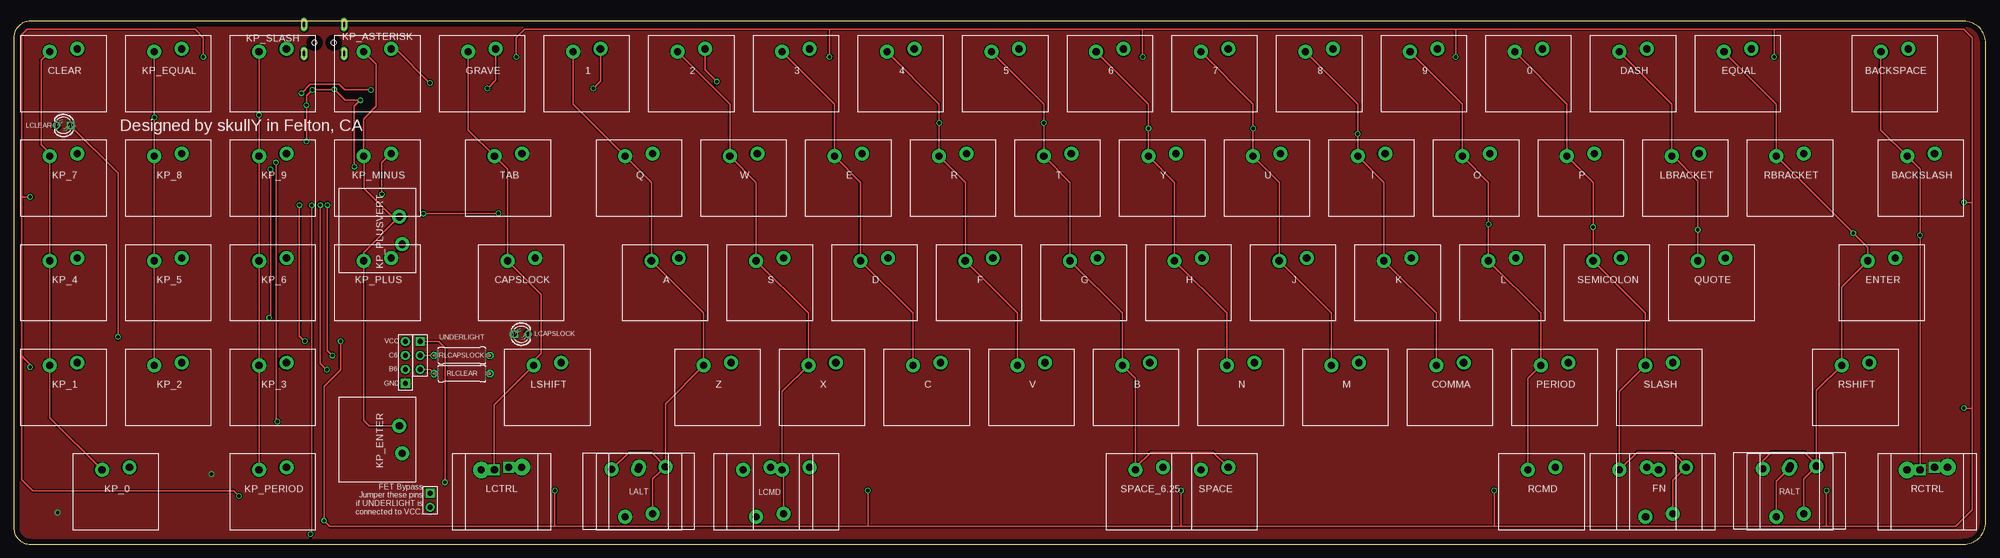
[diagram p3: board, top side]
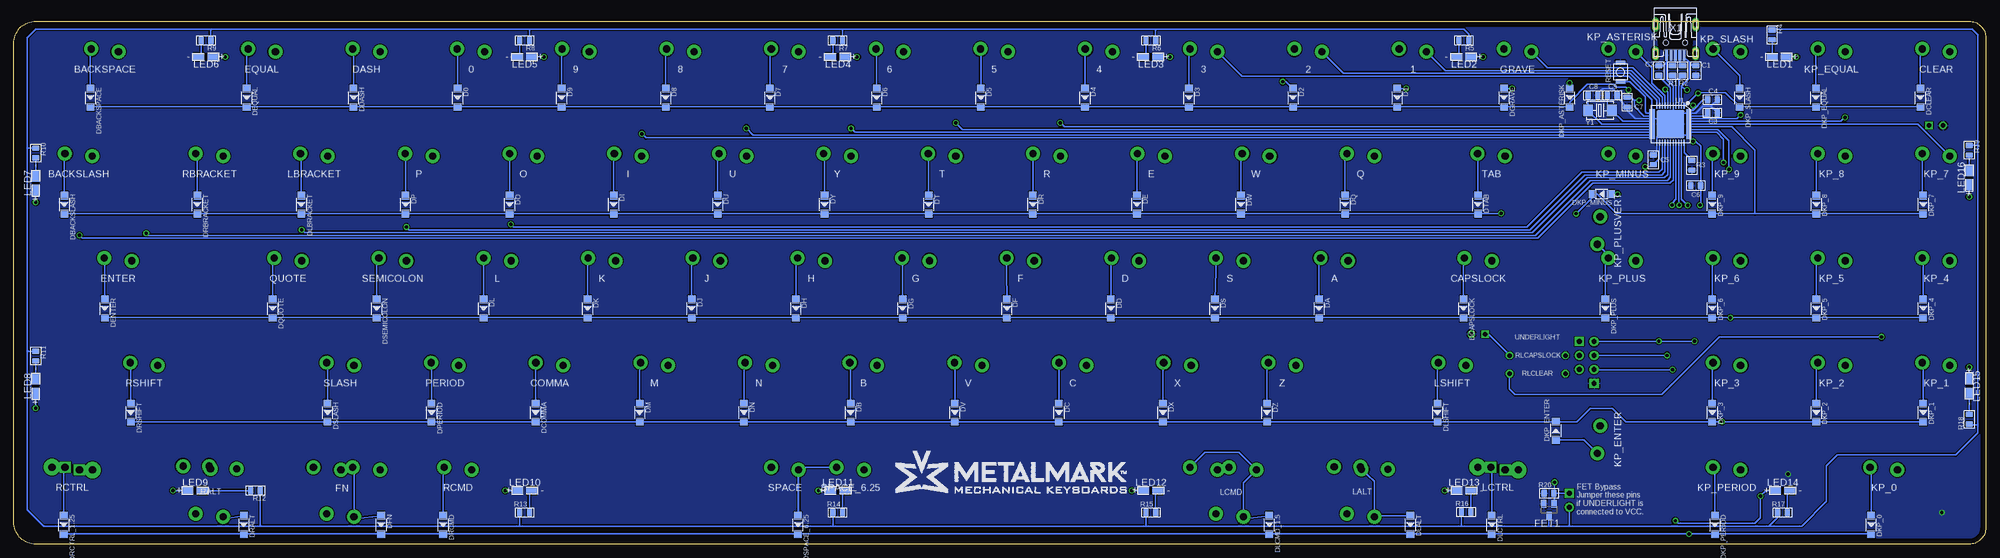
[diagram p4: board, bottom side, seen from below]

Size 359 x 95.28 mm. Coordinates in mm from the lower left corner, seen from the top.
Outline: 0,92.28 0,3 arc90 3,0 355,0 arc90 359,4 359,91.28 arc90 355,95.28 3,95.28 arc90 0,92.28
Copper layers (1*16): Top 0.035mm / dielectric 1.5mm / Bottom 0.035mm
Design rules "default *": minimum track width 10mil, minimum drill 0.6mm, track to track 0.2mm, track to pad 0.2mm, pad to pad 0.2mm, via to via 0.2mm, smd to smd 0mil, copper to edge 40mil, drill to drill 8mil, minimum pad ring 10mil, minimum via ring 8mil, stop-mask expansion 4mil, vias tented up to drill 0mil, thermal gap 10mil

### Footprints (pad centres in the part's own frame; a part is rotated, then mirrored left to right if it is on the bottom)
P-ALPS = drill 1.3 pad 2.54: ALPS1 -2.5,4; ALPS2 2.5,4.5
C0805 = smd 1.397 x 1.016: 1 0,0.889; 2 0,-0.889
SOD-123 = smd 1.397 x 1.397: + -1.651,0; - 1.651,0
SOT23 = smd 1 x 1.4: 1 -0.95,-1.1; 2 0.95,-1.1; 3 0,1.1
H3-2.54 = drill 0.889 pad 1.651 square: 1 0,2.54 | drill 0.889 pad 1.651: 2 0,0; 3 0,-2.54
H2-2.54 = drill 0.889 pad 1.651 square: 1 0,1.27 | drill 0.889 pad 1.651: 2 0,-1.27
H4-2.54 = drill 0.889 pad 1.651 square: 1 0,3.81 | drill 0.889 pad 1.651: 2 0,1.27; 3 0,-1.27; 4 0,-3.81
P-ALPS-2SWITCH-0.5 = drill 1.3 pad 2.54: ALPS1 -4.94,4.1; ALPS2 0.06,4.6; ALPS3 -0.17,4.1; ALPS4 4.83,4.6
LED2-2.54-D3.0MM = drill 0.813 square: A -1.27,0 | drill 0.813: K 1.27,0
P-ALPS-2SWITCH-0.25 = drill 1.3 pad 3: ALPS1 -3.7,4; ALPS4 3.68,4.5 | drill 1.3 pad 2 square: ALPS2 1.3,4.5; ALPS3 -1.32,4
P-SMD-LED-GENERIC = smd 2 x 1.3: MINUS 1.3,0; PLUS -1.3,0
R0805 = smd 1.397 x 1.016: 1 0,0.889; 2 0,-0.889
SW2-SMD-3.0X2.5X1.2+0.4MM = smd 0.8 x 1.7: 1 -1.7,0; 2 1.7,0
R0309_10 = drill 0.813 octagon: 1 -5.08,0; 2 5.08,0
QFN44G-0.5-7X7MM = smd 1 x 0.3: 1 -3.35,2.5; 2 -3.35,2; 3 -3.35,1.5; 4 -3.35,1; 5 -3.35,0.5; 6 -3.35,0; 7 -3.35,-0.5; 8 -3.35,-1; 9 -3.35,-1.5; 10 -3.35,-2; 11 -3.35,-2.5; 23 3.35,-2.5; 24 3.35,-2; 25 3.35,-1.5; 26 3.35,-1; 27 3.35,-0.5; 28 3.35,0; 29 3.35,0.5; 30 3.35,1; 31 3.35,1.5; 32 3.35,2; 33 3.35,2.5 | smd 0.3 x 1: 12 -2.5,-3.35; 13 -2,-3.35; 14 -1.5,-3.35; 15 -1,-3.35; 16 -0.5,-3.35; 17 0,-3.35; 18 0.5,-3.35; 19 1,-3.35; 20 1.5,-3.35; 21 2,-3.35; 22 2.5,-3.35; 34 2.5,3.35; 35 2,3.35; 36 1.5,3.35; 37 1,3.35; 38 0.5,3.35; 39 0,3.35; 40 -0.5,3.35; 41 -1,3.35; 42 -1.5,3.35; 43 -2,3.35; 44 -2.5,3.35 | smd 5.08 x 5.08: TAB 0,0
UX60-MB-5S8 = smd 2 x 0.5: 1 8.65,1.6; 2 8.65,0.8; 3 8.65,0; 4 8.65,-0.8; 5 8.65,-1.6 | drill 0.8 long: M1 3.1,-3.65; M2 3.1,3.65; M3 8.4,3.65; M4 8.4,-3.65 | hole 0.9: 6.4,-1.75; 6.4,1.75
X2-SMD-5.0X3.2X1.3MM = smd 1.778 x 2.032: 1 -2.159,0; 2 2.159,0

### Placement (x,y rotation side)
0  275.75,85.73 0 top
1  104.3,85.73 0 top
2  123.35,85.73 0 top
3  142.4,85.73 0 top
4  161.45,85.73 0 top
5  180.5,85.73 0 top
6  199.55,85.73 0 top
7  218.6,85.73 0 top
8  237.65,85.73 0 top
9  256.7,85.73 0 top
A  118.58,47.63 0 top
B  204.31,28.58 0 top
BACKSLASH  347.18,66.68 0 top
BACKSPACE  342.42,85.73 0 top
C  166.21,28.58 0 top
C1  52.8,86.28 0 bottom
C2  59.5,86.28 180 bottom
C3  49.75,78.58 90 bottom
C4  49.75,80.98 90 bottom
C5  60.5,70.03 180 bottom
C6  52.8,65.33 270 bottom
C7  65.3,80.53 0 bottom
C8  71.5,81.78 90 bottom
C9  68,81.78 90 bottom
CAPSLOCK  92.39,47.63 0 top
CLEAR  9.05,85.73 0 top
COMMA  261.46,28.58 0 top
D  156.68,47.63 0 top
D0  278.2,81.33 270 bottom
D1  107.15,81.33 270 bottom
D2  126.1,81.33 270 bottom
D3  145.05,81.33 270 bottom
D4  164,81.33 270 bottom
D5  182.95,81.33 270 bottom
D6  201.9,81.33 270 bottom
D7  221.35,81.33 270 bottom
D8  240.3,81.33 270 bottom
D9  259.25,81.33 270 bottom
DA  121.37,42.93 270 bottom
DASH  294.8,85.73 0 top
DB  206.64,23.98 270 bottom
DBACKSLASH  349.77,61.88 270 bottom
DBACKSPACE  345.03,81.33 270 bottom
DC  168.74,23.98 270 bottom
DCAPSLOCK  95.06,42.93 270 bottom
DCLEAR  11.9,81.33 270 bottom
DCOMMA  263.99,23.98 270 bottom
DD  159.27,42.93 270 bottom
DDASH  297.15,81.33 270 bottom
DE  154.53,61.88 270 bottom
DENTER  342.41,42.93 270 bottom
DEQUAL  316.6,81.33 270 bottom
DF  178.22,42.93 270 bottom
DFN  292.11,3.53 270 bottom
DG  197.17,42.93 270 bottom
DGRAVE  87.7,81.33 270 bottom
DH  216.62,42.93 270 bottom
DI  249.78,61.88 270 bottom
DJ  235.57,42.93 270 bottom
DK  254.52,42.93 270 bottom
DKP_0  20.88,3.53 270 bottom
DKP_1  11.4,23.98 270 bottom
DKP_2  30.85,23.98 270 bottom
DKP_3  49.8,23.98 270 bottom
DKP_4  11.4,42.93 270 bottom
DKP_5  30.85,42.93 270 bottom
DKP_6  49.8,42.93 270 bottom
DKP_7  11.4,61.88 270 bottom
DKP_8  30.85,61.88 270 bottom
DKP_9  49.8,61.88 270 bottom
DKP_ASTERISK  75.75,81.33 270 bottom
DKP_ENTER  78.25,20.68 90 bottom
DKP_EQUAL  30.92,81.33 270 bottom
DKP_MINUS  69.9,63.78 180 bottom
DKP_PERIOD  49.3,3.53 270 bottom
DKP_PLUS  69.25,42.93 270 bottom
DKP_SLASH  44.8,81.33 270 bottom
DL  273.47,42.93 270 bottom
DLALT  104.75,3.53 270 bottom
DLBRACKET  306.63,61.88 270 bottom
DLCMD_1.5  130.45,3.53 270 bottom
DLCTRL  89.94,3.53 270 bottom
DLSHIFT  99.8,23.98 270 bottom
DM  245.04,23.98 270 bottom
DN  226.09,23.98 270 bottom
DO  268.73,61.88 270 bottom
DP  287.68,61.88 270 bottom
DPERIOD  282.94,23.98 270 bottom
DQ  116.63,61.88 270 bottom
DQUOTE  311.87,42.93 270 bottom
DR  173.48,61.88 270 bottom
DRALT  317.1,3.53 270 bottom
DRBRACKET  325.58,61.88 270 bottom
DRCMD  280.82,3.53 270 bottom
DRCTRL_1.25  349.89,3.53 270 bottom
DRSHIFT  337.67,23.98 270 bottom
DS  140.32,42.93 270 bottom
DSEMICOLON  292.92,42.93 270 bottom
DSLASH  301.89,23.98 270 bottom
DSPACE_6.25  216.26,3.53 270 bottom
DT  192.43,61.88 270 bottom
DTAB  92.44,61.88 270 bottom
DU  230.83,61.88 270 bottom
DV  187.69,23.98 270 bottom
DW  135.58,61.88 270 bottom
DX  149.79,23.98 270 bottom
DY  211.38,61.88 270 bottom
DZ  130.84,23.98 270 bottom
E  151.92,66.68 0 top
ENTER  340.04,47.63 0 top
EQUAL  313.85,85.73 0 top
F  175.73,47.63 0 top
FET1  79.5,6.28 180 bottom
FN  301.94,9.53 0 top
G  194.78,47.63 0 top
GRAVE  85.25,85.73 0 top
H  213.83,47.63 0 top
I  247.17,66.68 0 top
J  232.88,47.63 0 top
J2  74,34.38 0 top
J3  75.8,7.98 0 top
J4  71.3,33.11 180 top
K  251.93,47.63 0 top
KP_0  18.57,9.53 0 top
KP_1  9.05,28.58 0 top
KP_2  28.1,28.58 0 top
KP_3  47.15,28.58 0 top
KP_4  9.05,47.63 0 top
KP_5  28.1,47.63 0 top
KP_6  47.15,47.63 0 top
KP_7  9.05,66.68 0 top
KP_8  28.1,66.68 0 top
KP_9  47.15,66.68 0 top
KP_ASTERISK  66.2,85.73 0 top
KP_ENTER  66.2,19.05 270 top
KP_EQUAL  28.1,85.73 0 top
KP_MINUS  66.2,66.68 0 top
KP_PERIOD  47.15,9.53 0 top
KP_PLUS  66.2,47.63 0 top
KP_PLUSVERT  66.2,57.15 270 top
KP_SLASH  47.15,85.73 0 top
L  270.98,47.63 0 top
LALT  113.8,9.53 0 top
LALT7  113.82,9.53 180 top
LBRACKET  304.32,66.68 0 top
LCAPSLOCK  92.39,38.28 0 top
LCLEAR  9.05,76.28 180 top
LCMD1  135.25,9.53 0 top
LCMD2  142.4,9.53 0 top
LCMD7  137.63,9.53 180 top
LCTRL  88.81,9.53 0 top
LED1  37.6,88.78 180 bottom
LED2  95,88.78 180 bottom
LED3  152,88.78 180 bottom
LED4  209,88.78 180 bottom
LED5  266,88.78 180 bottom
LED6  324,88.78 180 bottom
LED7  355,65.78 90 bottom
LED8  355,28.78 90 bottom
LED9  326,9.78 0 bottom
LED10  266,9.78 0 bottom
LED11  209,9.78 0 bottom
LED12  152,9.78 0 bottom
LED13  95,9.78 0 bottom
LED14  37,9.78 0 bottom
LED15  3,28.78 270 bottom
LED16  3,66.78 90 bottom
LSHIFT  97.15,28.58 0 top
M  242.41,28.58 0 top
N  223.36,28.58 0 top
O  266.22,66.68 0 top
P  285.27,66.68 0 top
PERIOD  280.51,28.58 0 top
Q  113.82,66.68 0 top
QUOTE  309.08,47.63 0 top
R  170.97,66.68 0 top
R1  57,86.28 0 bottom
R2  55.2,86.28 0 bottom
R3  53.5,69.03 0 bottom
R4  38.9,92.78 0 bottom
R5  95,91.78 270 bottom
R6  152,91.78 270 bottom
R7  209,91.78 270 bottom
R8  266,91.78 270 bottom
R9  324,91.78 270 bottom
R10  355,71.28 0 bottom
R11  355,34.28 0 bottom
R12  315,9.78 270 bottom
R13  266,5.78 90 bottom
R14  209,5.78 90 bottom
R15  152,5.78 90 bottom
R16  94.6,5.88 90 bottom
R17  37,5.78 90 bottom
R18  3,22.78 180 bottom
R19  3,71.78 0 bottom
R20  79.5,9.28 90 bottom
RALT  323.35,9.62 0 top
RALT_7  323.37,9.53 180 top
RBRACKET  323.37,66.68 0 top
RCMD  278.13,9.53 0 top
RCMD2  294.8,9.53 0 top
RCMD_7  299.56,9.53 180 top
RCTRL  348.36,9.53 0 top
RESET  66.5,86.03 270 bottom
RLCAPSLOCK  81.6,34.38 0 top
RLCLEAR  81.6,31.08 0 top
RSHIFT  335.28,28.58 0 top
S  137.63,47.63 0 top
SEMICOLON  290.03,47.63 0 top
SLASH  299.56,28.58 0 top
SPACE  218.6,9.53 0 top
SPACE_6.25  206.69,9.53 0 top
T  190.02,66.68 0 top
TAB  90.01,66.68 0 top
U  228.12,66.68 0 top
U1  57.4,76.53 270 bottom
V  185.26,28.58 0 top
W  132.87,66.68 0 top
X  147.16,28.58 0 top
X1  56.5,97.78 270 bottom
Y  209.07,66.68 0 top
Y1  70.25,79.03 0 bottom
Z  128.11,28.58 0 top

### Tracks (layer width: path | path; a pad name or v marks a point on that pad's centre or on a via)
COLUMN1
  Top 0.3: KP_0.ALPS1 6.55,23.05 KP_1.ALPS1 KP_4.ALPS1 KP_7.ALPS1 6.55,71.23 5,72.78 5,88.18 CLEAR.ALPS1
  Bottom 0.3: U1.39 12.4,76.53 KP_7.ALPS1
COLUMN2  (via drill 0.6)
  Top 0.3: KP_2.ALPS1 KP_5.ALPS1 KP_8.ALPS1 v25.6,77.78 KP_EQUAL.ALPS1
  Bottom 0.3: U1.40 26.35,77.03 v25.6,77.78
COLUMN3  (via drill 0.6)
  Top 0.3: KP_PERIOD.ALPS1 KP_3.ALPS1 KP_6.ALPS1 KP_9.ALPS1 v44.65,78.18 KP_SLASH.ALPS1
  Bottom 0.3: U1.41 45.3,77.53 v44.65,78.18
COLUMN4
  Top 0.3: KP_ASTERISK.ALPS1 66,87.43 66,79.78 63.7,77.48 KP_MINUS.ALPS1 63.75,70.62 63.75,64.78 68.88,59.65 KP_PLUSVERT.ALPS1 63.7,53.15 KP_PLUS.ALPS1 63.7,22.58 64.7,21.58 70.17,21.58 KP_ENTER.ALPS1
  Bottom 0.3: U1.8 58.4,81.68 60.75,84.03 60.75,86.78 KP_ASTERISK.ALPS1
COLUMN5
  Top 0.3: LCTRL.ALPS1 LCTRL.ALPS3 87.49,25.42 LSHIFT.ALPS1 94.65,33.43 96,34.78 96,45.52 CAPSLOCK.ALPS1 89.89,68.3 TAB.ALPS1 82.75,75.44 GRAVE.ALPS1
  Bottom 0.3: U1.9 58.9,81.43 64.25,86.78 79.8,86.78 GRAVE.ALPS1
COLUMN6
  Top 0.3: LALT.ALPS4 118.63,25.59 Z.ALPS1 125.61,42.1 A.ALPS1 116.08,65.92 Q.ALPS1 101.8,80.2 1.ALPS1 | LALT.ALPS4 116.08,16.78 112,16.78 108.95,13.73 LALT.ALPS1 | LALT7.ALPS1 116.32,11.92 LALT.ALPS4
  Bottom 0.3: U1.10 59.4,81.18 64.5,86.28 98.35,86.28 1.ALPS1
COLUMN7
  Top 0.3: LCMD2.ALPS1 139.9,27.82 X.ALPS1 144.66,42.1 S.ALPS1 135.13,65.92 W.ALPS1 130.37,80.21 2.ALPS1 | LCMD2.ALPS1 138.25,13.53 LCMD1.ALPS2 | LCMD7.ALPS1 140.13,13.3 LCMD2.ALPS1
  Bottom 0.3: U1.11 59.9,80.93 64.75,85.78 116.9,85.78 2.ALPS1
COLUMN8
  Top 0.3: C.ALPS1 163.71,42.1 D.ALPS1 154.18,65.92 E.ALPS1 149.42,80.21 3.ALPS1
  Bottom 0.3: U1.12 60.75,81.03 65,85.28 135.45,85.28 3.ALPS1
COLUMN9  (via drill 0.6)
  Top 0.3: V.ALPS1 182.76,42.1 F.ALPS1 173.23,65.92 R.ALPS1 v168.47,76.78 168.47,80.21 4.ALPS1
  Bottom 0.3: U1.18 167.72,76.03 v168.47,76.78
COLUMN10  (via drill 0.6)
  Top 0.3: SPACE.ALPS2 218.35,16.78 207,16.78 204.19,13.97 SPACE_6.25.ALPS1 204.19,30.2 B.ALPS1 201.81,42.1 G.ALPS1 192.28,65.92 T.ALPS1 v187.52,76.78 187.52,80.21 5.ALPS1
  Bottom 0.3: U1.19 186.27,75.53 v187.52,76.78
COLUMN11  (via drill 0.6)
  Top 0.3: N.ALPS1 220.86,42.1 H.ALPS1 211.33,65.92 Y.ALPS1 v206.57,75.78 206.57,80.21 6.ALPS1
  Bottom 0.3: U1.20 205.82,75.03 v206.57,75.78
COLUMN12  (via drill 0.6)
  Top 0.3: M.ALPS1 239.91,42.1 J.ALPS1 230.38,65.92 U.ALPS1 v225.62,75.78 225.62,80.21 7.ALPS1
  Bottom 0.3: U1.21 224.37,74.53 v225.62,75.78
COLUMN13  (via drill 0.6)
  Top 0.3: COMMA.ALPS1 258.96,42.1 K.ALPS1 249.43,65.92 I.ALPS1 v244.67,74.78 244.67,80.21 8.ALPS1
  Bottom 0.3: U1.22 243.92,74.03 v244.67,74.78
COLUMN14  (via drill 0.6)
  Top 0.3: RCMD.ALPS1 275.63,30.2 PERIOD.ALPS1 278.01,42.1 L.ALPS1 v268.48,58.28 268.48,65.92 O.ALPS1 263.72,80.21 9.ALPS1
  Bottom 0.3: U1.25 58.9,68.38 59.5,67.78 73.5,67.78 83.5,57.78 267.98,57.78 v268.48,58.28
COLUMN15  (via drill 0.6)
  Top 0.3: 0.ALPS1 282.77,80.21 P.ALPS1 287.53,65.92 v287.53,57.78 SEMICOLON.ALPS1 297.06,42.1 SLASH.ALPS1 292.3,27.82 RCMD2.ALPS1 295.55,16.78 302,16.78 304.44,14.34 FN.ALPS2 302.06,11.65 RCMD_7.ALPS1
  Bottom 0.3: U1.26 58.4,67.88 59,67.28 73,67.28 83,57.28 287.03,57.28 v287.53,57.78
COLUMN16  (via drill 0.6)
  Top 0.3: QUOTE.ALPS1 v306.58,57.28 306.58,66.2 302,70.78 301.92,70.78 LBRACKET.ALPS1 301.82,80.21 DASH.ALPS1
  Bottom 0.3: U1.27 57.9,67.38 58.5,66.78 72.5,66.78 82.5,56.78 306.08,56.78 v306.58,57.28
COLUMN17  (via drill 0.6)
  Top 0.3: RALT.ALPS4 328.18,27.98 RSHIFT.ALPS1 332.78,46.87 ENTER.ALPS1 337.54,54.01 v334.88,56.66 RBRACKET.ALPS1 320.87,80.21 EQUAL.ALPS1 | RALT.ALPS4 328.18,14.59 326,16.78 320,16.78 318.41,15.19 RALT.ALPS1 | RALT_7.ALPS1 325.87,11.92 RALT.ALPS4
  Bottom 0.3: U1.28 57.4,66.88 58,66.28 72,66.28 82,56.28 334.5,56.28 v334.88,56.66
COLUMN18  (via drill 0.6)
  Top 0.3: BACKSPACE.ALPS1 339.92,75.44 BACKSLASH.ALPS1 347.04,68.31 v347.04,56.28 RCTRL.ALPS3 RCTRL.ALPS1
  Bottom 0.3: U1.29 56.9,66.38 57.5,65.78 71.5,65.78 81.5,55.78 82,55.78 82.5,55.78 346.54,55.78 v347.04,56.28
GND  (via drill 0.6)
  Bottom 0.3: 56.9,77.12 55.5,78.53 U1.43 52.75,78.53 51.5,79.78 50.06,79.78 50.03,79.81 | 56.9,77.12 U1.5 56.9,83.43 58.08,84.6 58.08,87.78 | 56.9,77.12 57.5,76.53 | 57.5,76.53 58.5,77.53 U1.15 63.75,77.53 65.25,79.03 65.25,79.59 C7.2 67.11,81.45 C9.2 67.11,82.14 68,83.03 69.75,83.03 70.25,82.53 70.25,82.14 C8.2 | 57.5,76.53 59.9,74.12 U1.23 59.9,71.51 C5.2 | 57.5,76.53 57.4,76.43 U1.TAB 55.4,74.53 U1.35 | C2.2 58.69,87.16 58.08,87.78 | 50.03,79.81 C4.2 | C3.2 48.86,78.64 50.03,79.81 | X1.5 58.1,87.8 58.08,87.78
  other vias: 36,12.78 8,5.78
  pour Bottom: 0,95.28 0,-0.22 359,-0.22 359,95.28
  pour Top: 359,95.28 359,-0.22 0,-0.22 0,95.28
LCAPSLOCK
  Bottom 0.3: LCAPSLOCK.A 90.58,38.28 RLCAPSLOCK.2
LCLEAR  (via drill 0.6)
  Top 0.3: v19,37.78 19,67.59 LCLEAR.A
  Bottom 0.3: v19,37.78 48.5,37.78 59,27.28 85.7,27.28 86.7,28.28 86.7,31.06 RLCLEAR.2
LED1  (via drill 0.6)
  Top 0.3: v57.1,61.78 57.1,35.28 v58,34.38
  Bottom 0.3: U1.30 56.4,62.88 57,62.28 v57.1,61.78 | v58,34.38 J4.3
LED2  (via drill 0.6)
  Top 0.3: v55.8,61.78 55.8,32.98 v57,31.78
  Bottom 0.3: U1.31 55.9,61.88 v55.8,61.78 | v57,31.78 71.24,31.78 J4.2
N$1
  Bottom 0.3: DCLEAR.+ 11.9,89.88 CLEAR.ALPS2
N$2
  Bottom 0.3: DKP_SLASH.+ 44.8,85.38 KP_SLASH.ALPS2
N$3  (via drill 0.6)
  Top 0.3: v75.75,84.03 69.55,90.23 KP_ASTERISK.ALPS2
  Bottom 0.3: DKP_ASTERISK.+ v75.75,84.03
N$4  (via drill 0.6)
  Top 0.3: v67,63.78 67,69.48 KP_MINUS.ALPS2
  Bottom 0.3: DKP_MINUS.+ v67,63.78
N$5  (via drill 0.6)
  Top 0.3: GRAVE.ALPS2 87.75,84.53 v86.25,83.03
  Bottom 0.3: v86.25,83.03 87.65,83.03 DGRAVE.+
N$6  (via drill 0.6)
  Top 0.3: 1.ALPS2 106.8,84.33 v105.5,83.03
  Bottom 0.3: v105.5,83.03 107.1,83.03 D1.+
N$7  (via drill 0.6)
  Top 0.3: 2.ALPS2 125.85,86.43 v128,84.28
  Bottom 0.3: v128,84.28 127.4,84.28 D2.+
N$8
  Bottom 0.3: D3.+ 145.05,90.08 3.ALPS2
N$9
  Bottom 0.3: D4.+ 164,90.18 4.ALPS2
N$10
  Bottom 0.3: D5.+ 182.95,90.18 5.ALPS2
N$11
  Bottom 0.3: D6.+ 201.9,90.08 6.ALPS2
N$12
  Bottom 0.3: D7.+ 221.35,89.98 7.ALPS2
N$13
  Bottom 0.3: D8.+ 240.3,90.08 8.ALPS2
N$14
  Bottom 0.3: D9.+ 259.25,90.18 9.ALPS2
N$15
  Bottom 0.3: D0.+ 278.2,90.18 0.ALPS2
N$16
  Bottom 0.3: DDASH.+ 297.15,90.08 DASH.ALPS2
N$17
  Bottom 0.3: DEQUAL.+ 316.6,89.98 EQUAL.ALPS2
N$18
  Bottom 0.3: DBACKSPACE.+ 345.03,90.12 BACKSPACE.ALPS2
N$19
  Bottom 0.3: KP_7.ALPS2 11.55,63.68 DKP_7.+
N$20
  Bottom 0.3: DKP_8.+ 30.85,70.93 KP_8.ALPS2
N$21
  Bottom 0.3: DKP_9.+ 49.8,71.03 KP_9.ALPS2
N$22
  Bottom 0.3: DKP_PLUS.+ 69.25,51.58 KP_PLUS.ALPS2 68.7,52.65 KP_PLUSVERT.ALPS2
N$23
  Bottom 0.3: DTAB.+ 92.44,71.11 TAB.ALPS2
N$24
  Bottom 0.3: DQ.+ 116.63,70.87 Q.ALPS2
N$25
  Bottom 0.3: DW.+ 135.58,70.97 W.ALPS2
N$26
  Bottom 0.3: DE.+ 154.53,71.06 E.ALPS2
N$27
  Bottom 0.3: DR.+ R.ALPS2
N$28
  Bottom 0.3: DT.+ 192.43,71.09 T.ALPS2
N$29
  Bottom 0.3: DY.+ 211.38,70.99 Y.ALPS2
N$30
  Bottom 0.3: DU.+ 230.83,70.97 U.ALPS2
N$31
  Bottom 0.3: DI.+ 249.78,71.06 I.ALPS2
N$32
  Bottom 0.3: O.ALPS2 268.72,68.54 DO.+
N$33
  Bottom 0.3: DP.+ 287.68,71.09 P.ALPS2
N$34
  Bottom 0.3: DLBRACKET.+ 306.63,70.99 LBRACKET.ALPS2
N$35
  Bottom 0.3: DRBRACKET.+ 325.58,70.89 RBRACKET.ALPS2
N$36
  Bottom 0.3: DBACKSLASH.+ 349.77,71.09 BACKSLASH.ALPS2
N$37
  Bottom 0.3: DKP_4.+ 11.4,51.98 KP_4.ALPS2
N$38
  Bottom 0.3: DKP_5.+ 30.85,51.88 KP_5.ALPS2
N$39
  Bottom 0.3: DKP_6.+ 49.8,51.98 KP_6.ALPS2
N$40
  Bottom 0.3: DCAPSLOCK.+ 95.06,51.96 CAPSLOCK.ALPS2
N$41
  Bottom 0.3: DA.+ 121.37,51.84 A.ALPS2
N$42
  Bottom 0.3: S.ALPS2 140.13,49.77 DS.+
N$43
  Bottom 0.3: DD.+ 159.27,52.04 D.ALPS2
N$44
  Bottom 0.3: F.ALPS2 178.23,49.59 DF.+
N$45
  Bottom 0.3: DG.+ 197.17,52.02 G.ALPS2
N$46
  Bottom 0.3: DH.+ 216.62,51.84 H.ALPS2
N$47
  Bottom 0.3: DJ.+ 235.57,51.94 J.ALPS2
N$48
  Bottom 0.3: DK.+ 254.52,52.04 K.ALPS2
N$49
  Bottom 0.3: DL.+ L.ALPS2
N$50
  Bottom 0.3: DSEMICOLON.+ 292.92,51.74 SEMICOLON.ALPS2
N$51
  Bottom 0.3: DQUOTE.+ 311.87,51.84 QUOTE.ALPS2
N$52
  Bottom 0.3: DENTER.+ 342.41,52 ENTER.ALPS2
N$53
  Bottom 0.3: DKP_1.+ 11.4,32.93 KP_1.ALPS2
N$54
  Bottom 0.3: DKP_2.+ 30.85,32.83 KP_2.ALPS2
N$55
  Bottom 0.3: DKP_3.+ 49.8,32.93 KP_3.ALPS2
N$56
  Bottom 0.3: DKP_ENTER.+ 73.17,19.02 KP_ENTER.ALPS2
N$57
  Bottom 0.3: DLSHIFT.+ 99.8,32.93 LSHIFT.ALPS2
N$58
  Bottom 0.3: DZ.+ 130.84,32.84 Z.ALPS2
N$59
  Bottom 0.3: DX.+ 149.79,32.95 X.ALPS2
N$60
  Bottom 0.3: DC.+ 168.74,33.05 C.ALPS2
N$61
  Bottom 0.3: DV.+ 187.69,33.01 V.ALPS2
N$62
  Bottom 0.3: DB.+ 206.64,32.91 B.ALPS2
N$63
  Bottom 0.3: DN.+ 226.09,32.84 N.ALPS2
N$64
  Bottom 0.3: DM.+ 245.04,32.95 M.ALPS2
N$65
  Bottom 0.3: DCOMMA.+ 263.99,33.05 COMMA.ALPS2
N$66
  Bottom 0.3: DPERIOD.+ 282.94,33.01 PERIOD.ALPS2
N$67
  Bottom 0.3: DSLASH.+ 301.89,32.91 SLASH.ALPS2
N$68
  Bottom 0.3: DRSHIFT.+ 337.67,32.97 RSHIFT.ALPS2
N$69
  Bottom 0.3: DKP_0.+ 20.88,13.84 KP_0.ALPS2
N$70
  Bottom 0.3: DKP_PERIOD.+ 49.3,13.68 KP_PERIOD.ALPS2
N$71
  Bottom 0.3: DLCTRL.+ 89.94,13.86 LCTRL.ALPS2 LCTRL.ALPS4
N$72
  Bottom 0.3: FN.ALPS1 297.8,13.53 RCMD2.ALPS2 297.06,13.79 RCMD_7.ALPS2 296.71,4.68 DFN.+
N$73
  Bottom 0.3: U1.4 56.4,84.79 R1.2
N$74
  Bottom 0.3: U1.3 55.9,84.69 R2.2
N$75
  Bottom 0.3: DKP_EQUAL.+ 30.92,89.9 KP_EQUAL.ALPS2
N$76
  Bottom 0.3: LALT.ALPS2 113.86,13.96 LALT.ALPS3 111.32,11.42 LALT7.ALPS2 111.17,5.18 DLALT.+
N$77
  Bottom 0.3: U1.6 57.4,83.18 59.5,85.28 C2.1
N$78
  Bottom 0.3: LCMD2.ALPS2 142.15,16.78 136,16.78 LCMD1.ALPS1 135.13,11.15 LCMD7.ALPS2 134.78,4.68 DLCMD_1.5.+
N$79
  Bottom 0.3: 209.26,13.96 SPACE_6.25.ALPS2 215.6,14.03 SPACE.ALPS1
  Bottom 0.406: DSPACE_6.25.+ 216.1,5.18 SPACE.ALPS1
N$80
  Bottom 0.3: U1.17 69.91,76.53 Y1.1 72.41,81.76 C8.1
N$81
  Bottom 0.3: DRCMD.+ 280.82,13.84 RCMD.ALPS2
N$82
  Bottom 0.3: U1.16 66.09,77.03 Y1.2 68.89,79.82 C9.1
N$83
  Bottom 0.3: U1.33 54.9,71.31 R3.1
N$84
  Bottom 0.3: U1.42 51.19,78.03 C3.1
N$85
  Top 0.3: RALT_7.ALPS2 320.87,11.42 RALT.ALPS3 323.18,14 RALT.ALPS2
  Bottom 0.3: DRALT.+ 320.52,4.68 RALT_7.ALPS2
N$86
  Top 0.3: J2.2 RLCAPSLOCK.1
N$87
  Bottom 0.3: DRCTRL_1.25.+ 349.89,13.8 RCTRL.ALPS2 RCTRL.ALPS4
N$88
  Bottom 0.3: R1.1 56.5,87.66 X1.3
N$89
  Bottom 0.3: 55.71,87.68 R2.1 55.7,87.66 X1.2
N$90
  Top 0.3: J2.3 75.76,31.84 RLCLEAR.1
N$91
  Bottom 0.3: R4.2 LED1.MINUS
N$92
  Bottom 0.3: R5.2 95.89,89.19 LED2.MINUS
N$93
  Bottom 0.3: R6.2 152.89,89.19 LED3.MINUS
N$94
  Bottom 0.3: R7.2 209.89,89.19 LED4.MINUS
N$95
  Bottom 0.3: R8.2 266.89,89.19 LED5.MINUS
N$96
  Bottom 0.3: R9.2 324.89,89.19 LED6.MINUS
N$97
  Bottom 0.3: LED15.MINUS R18.2
N$98
  Bottom 0.3: LED16.MINUS R19.2
N$99
  Bottom 0.3: R15.2 151.11,9.36 LED12.MINUS
N$100
  Bottom 0.3: R14.2 208.11,9.36 LED11.MINUS
N$101
  Bottom 0.3: R13.2 265.11,9.36 LED10.MINUS
N$102
  Bottom 0.3: R12.2 LED9.MINUS
N$103
  Bottom 0.3: LED8.MINUS R11.2
N$104
  Bottom 0.3: R10.2 LED7.MINUS
N$105
  Bottom 0.3: R17.2 36.11,9.36 LED14.MINUS
N$106
  Bottom 0.3: R16.2 LED13.MINUS
N$154  (via drill 0.6)
  Top 0.3: J2.1 77.36,36.92 78.5,35.78 v78.5,11.28
  Bottom 0.3: FET1.1 78.55,9.21 R20.2 | v78.5,11.28 78.5,9.39 R20.2 | J3.1 78.58,9.25 R20.2
RESET
  Bottom 0.3: U1.13 61.75,78.53 62,78.78 62,81.53 64.75,84.28 66.45,84.28 RESET.2
ROW1  (via drill 0.6)
  Top 0.3: v65,82.78 60.25,82.78 59.25,83.78 54,83.78 v52.38,82.15
  Bottom 0.3: DBACKSPACE.- DEQUAL.- DDASH.- D0.- D9.- D8.- D7.- D6.- D5.- D4.- D3.- D2.- D1.- DGRAVE.- DKP_ASTERISK.- 75.75,80.53 72.5,83.78 67.75,83.78 67.25,83.28 65.5,83.28 v65,82.78 | DKP_SLASH.- 44.9,79.67 | DCLEAR.- DKP_EQUAL.- DKP_SLASH.- | U1.1 54.65,79.88 v52.38,82.15 52.25,82.28 47.4,82.28 DKP_SLASH.-
ROW2  (via drill 0.6)
  Top 0.3: v88.25,60.28 74.6,60.28 v74.55,60.22
  Bottom 0.3: DKP_7.- DKP_8.- 42,60.22 | 42,60.22 DKP_9.- 67.2,60.22 70.75,63.78 DKP_MINUS.- 71.55,63.22 v74.55,60.22 | DBACKSLASH.- DRBRACKET.- DLBRACKET.- DP.- DO.- DI.- DU.- DY.- DT.- DR.- DE.- DW.- DQ.- DTAB.- 88.3,60.22 v88.25,60.28 | U1.38 46.25,76.03 42,71.78 42,60.22
ROW3  (via drill 0.6)
  Top 0.3: v46.75,68.28 46.75,41.52 v46.5,41.27
  Bottom 0.3: DKP_4.- DKP_5.- v46.5,41.27 DKP_6.- DKP_PLUS.- DCAPSLOCK.- DA.- DS.- DD.- DF.- DG.- DH.- DJ.- DK.- DL.- DSEMICOLON.- DQUOTE.- DENTER.- | U1.37 48.75,75.53 46.75,73.53 v46.75,68.28
ROW4  (via drill 0.6)
  Top 0.3: v47.75,69.53 47.75,22.57 v48,22.32
  Bottom 0.3: DKP_1.- DKP_2.- v48,22.32 DKP_3.- 65.55,22.32 68,24.78 72,24.78 74.45,22.33 DKP_ENTER.- DLSHIFT.- DZ.- DX.- DC.- DV.- DB.- DN.- DM.- DCOMMA.- DPERIOD.- DSLASH.- DRSHIFT.- | U1.36 49,75.03 47.75,73.78 v47.75,69.53
ROW5  (via drill 0.6)
  Top 0.3: v54.25,61.73 54.25,2.12 v54,1.87
  Bottom 0.3: DKP_0.- DKP_PERIOD.- v54,1.87 DLCTRL.- DLALT.- DLCMD_1.5.- DSPACE_6.25.- DRCMD.- DFN.- DRALT.- DRCTRL_1.25.- | U1.32 55.4,62.88 v54.25,61.73
UNDERLIGHT
  Bottom 0.3: 39.5,3.28 40,3.28 76,3.28 | 76,3.28 79.5,3.28 | 79.5,3.28 95.5,3.28 | 95.5,3.28 153,3.28 | 153,3.28 210,3.28 | 210,3.28 267,3.28 | 267,3.28 314,3.28 | 314,3.28 353.5,3.28 356.5,6.28 356.5,35.28 | 151,93.78 95,93.78 94.11,92.89 R5.1 | 151,93.78 208,93.78 | 208,93.78 265,93.78 | 265,93.78 323,93.78 | 323,93.78 355,93.78 356.5,92.28 356.5,72.28 | 356.5,72.28 356.5,35.28 | R16.1 95.49,3.29 95.5,3.28 | FET1.3 79.5,3.28 | J3.2 75.8,3.48 76,3.28 | 39.5,3.28 37.89,4.89 R17.1 | R15.1 152.89,3.39 153,3.28 | R14.1 209.89,3.39 210,3.28 | R13.1 266.89,3.39 267,3.28 | R12.1 314.11,3.39 314,3.28 | R11.1 356.39,35.16 356.5,35.28 | R10.1 356.39,72.16 356.5,72.28 | R9.1 323.11,93.66 323,93.78 | R8.1 265.11,93.66 265,93.78 | R7.1 208.11,93.66 208,93.78 | R6.1 151.11,93.66 151,93.78 | 39.01,93.78 R4.1 38.79,93.78 2.5,93.78 1.5,92.78 1.5,72.78 | 1.5,72.78 1.5,21.78 | 1.5,21.78 1.5,20.28 5.5,16.28 27,16.28 29,14.28 29,7.78 33.5,3.28 39.5,3.28 | 1.5,21.78 2.89,21.78 R18.1 | R19.1 1.61,72.66 1.5,72.78
VCC  (via drill 0.6)
  Top 0.3: v62,68.78 62,79.78 v63.1,80.88 60.35,80.88 v58.35,82.88 58.25,82.78 v54.4,82.78 53.3,81.68 v53.3,79.98 v53.3,73.38 | v52,61.78 52,37.98 v53,36.98 | 98.5,3.28 57.5,3.28 v56.5,4.28 56.5,28.78 59.5,31.78 v59.5,36.98 | 98.5,3.28 155.5,3.28 | 155.5,3.28 212.5,3.28 | 212.5,3.28 269.5,3.28 | 269.5,3.28 330,3.28 | 330,3.28 353.5,3.28 356.5,6.28 356.5,24.78 | 356.5,24.78 356.5,62.28 | 356.5,62.28 356.5,92.28 355,93.78 320.5,93.78 | 320.5,93.78 262.5,93.78 | 262.5,93.78 205.5,93.78 | 205.5,93.78 148.5,93.78 | 148.5,93.78 93,93.78 91.5,92.28 v91.5,88.78 | v98.5,9.78 98.5,3.28 | v155.5,9.78 155.5,3.28 | v212.5,9.78 212.5,3.28 | v269.5,9.78 269.5,3.28 | v330,9.78 330,3.28 | v355,24.78 356.5,24.78 | v355,62.28 356.5,62.28 | v320.5,88.78 320.5,93.78 | v262.5,88.78 262.5,93.78 | v205.5,88.78 205.5,93.78 | v148.5,88.78 148.5,93.78 | 1.5,63.28 1.5,92.78 2.5,93.78 33,93.78 34.5,92.28 v34.5,88.78 | v3,63.28 1.5,63.28 | 1.5,63.28 1.5,34.28 | 1.5,34.28 1.5,11.78 3.5,9.78 40,9.78 v41,8.78 | v3,32.28 3,32.78 1.5,34.28
  Bottom 0.3: 54,87.78 54.92,88.7 54.92,89.1 X1.1 | 54,87.78 54,84.88 55.4,83.48 | 55.4,83.48 U1.2 | C1.1 53.39,87.16 54,87.78 | U1.7 57.9,82.48 57.95,82.48 v58.35,82.88 | v54.4,82.78 54.7,82.78 55.4,83.48 | U1.14 62.25,78.03 64,79.78 64,80.78 64.1,80.88 | 64.1,80.88 65,81.78 | 65,81.78 65,81.71 | v63.1,80.88 64.1,80.88 | C7.1 65.3,81.48 65,81.78 | U1.24 59.4,70.24 C5.1 60.86,68.78 v62,68.78 | U1.44 53.35,79.03 | 53.35,79.03 51.4,80.98 C4.1 | 53.35,79.03 53.35,79.73 v53.3,79.98 | U1.34 53.95,74.03 v53.3,73.38 52.8,73.38 51.9,72.48 51.9,64.84 C6.1 51.91,61.86 v52,61.78 | v53,36.98 v59.5,36.98 71.24,36.98 J4.4 | v56.5,4.28 56,3.78 42,3.78 41,4.78 v41,8.78 40,9.78 LED14.PLUS | LED13.PLUS v98.5,9.78 | LED12.PLUS v155.5,9.78 | LED11.PLUS v212.5,9.78 | LED10.PLUS v269.5,9.78 | LED9.PLUS v330,9.78 | LED8.PLUS v355,24.78 | LED7.PLUS v355,62.28 | LED6.PLUS v320.5,88.78 | LED5.PLUS v262.5,88.78 | LED4.PLUS v205.5,88.78 | LED3.PLUS v148.5,88.78 | LED2.PLUS v91.5,88.78 | LED1.PLUS v34.5,88.78 | LED16.PLUS v3,63.28 | LED15.PLUS v3,32.28

### Text on the board
tPlace: Designed by skullY in Felton, CA | UNDERLIGHT | VCC | C6 | B6 | GND | LALT | LCMD | RALT | FET Bypass / Jumper these pins / if UNDERLIGHT is / connected to VCC.
bPlace: UNDERLIGHT | RLCAPSLOCK | RLCLEAR | LALT | LCMD | RALT | FET Bypass / Jumper these pins / if UNDERLIGHT is / connected to VCC.